# EasyEDA schematic Electric Mokka Pot.json
TITLE: Electric Mokka Pot; REV: 2.3; Date: 2022-07-10; Sheet: 1/1; Company: Kilian Eller
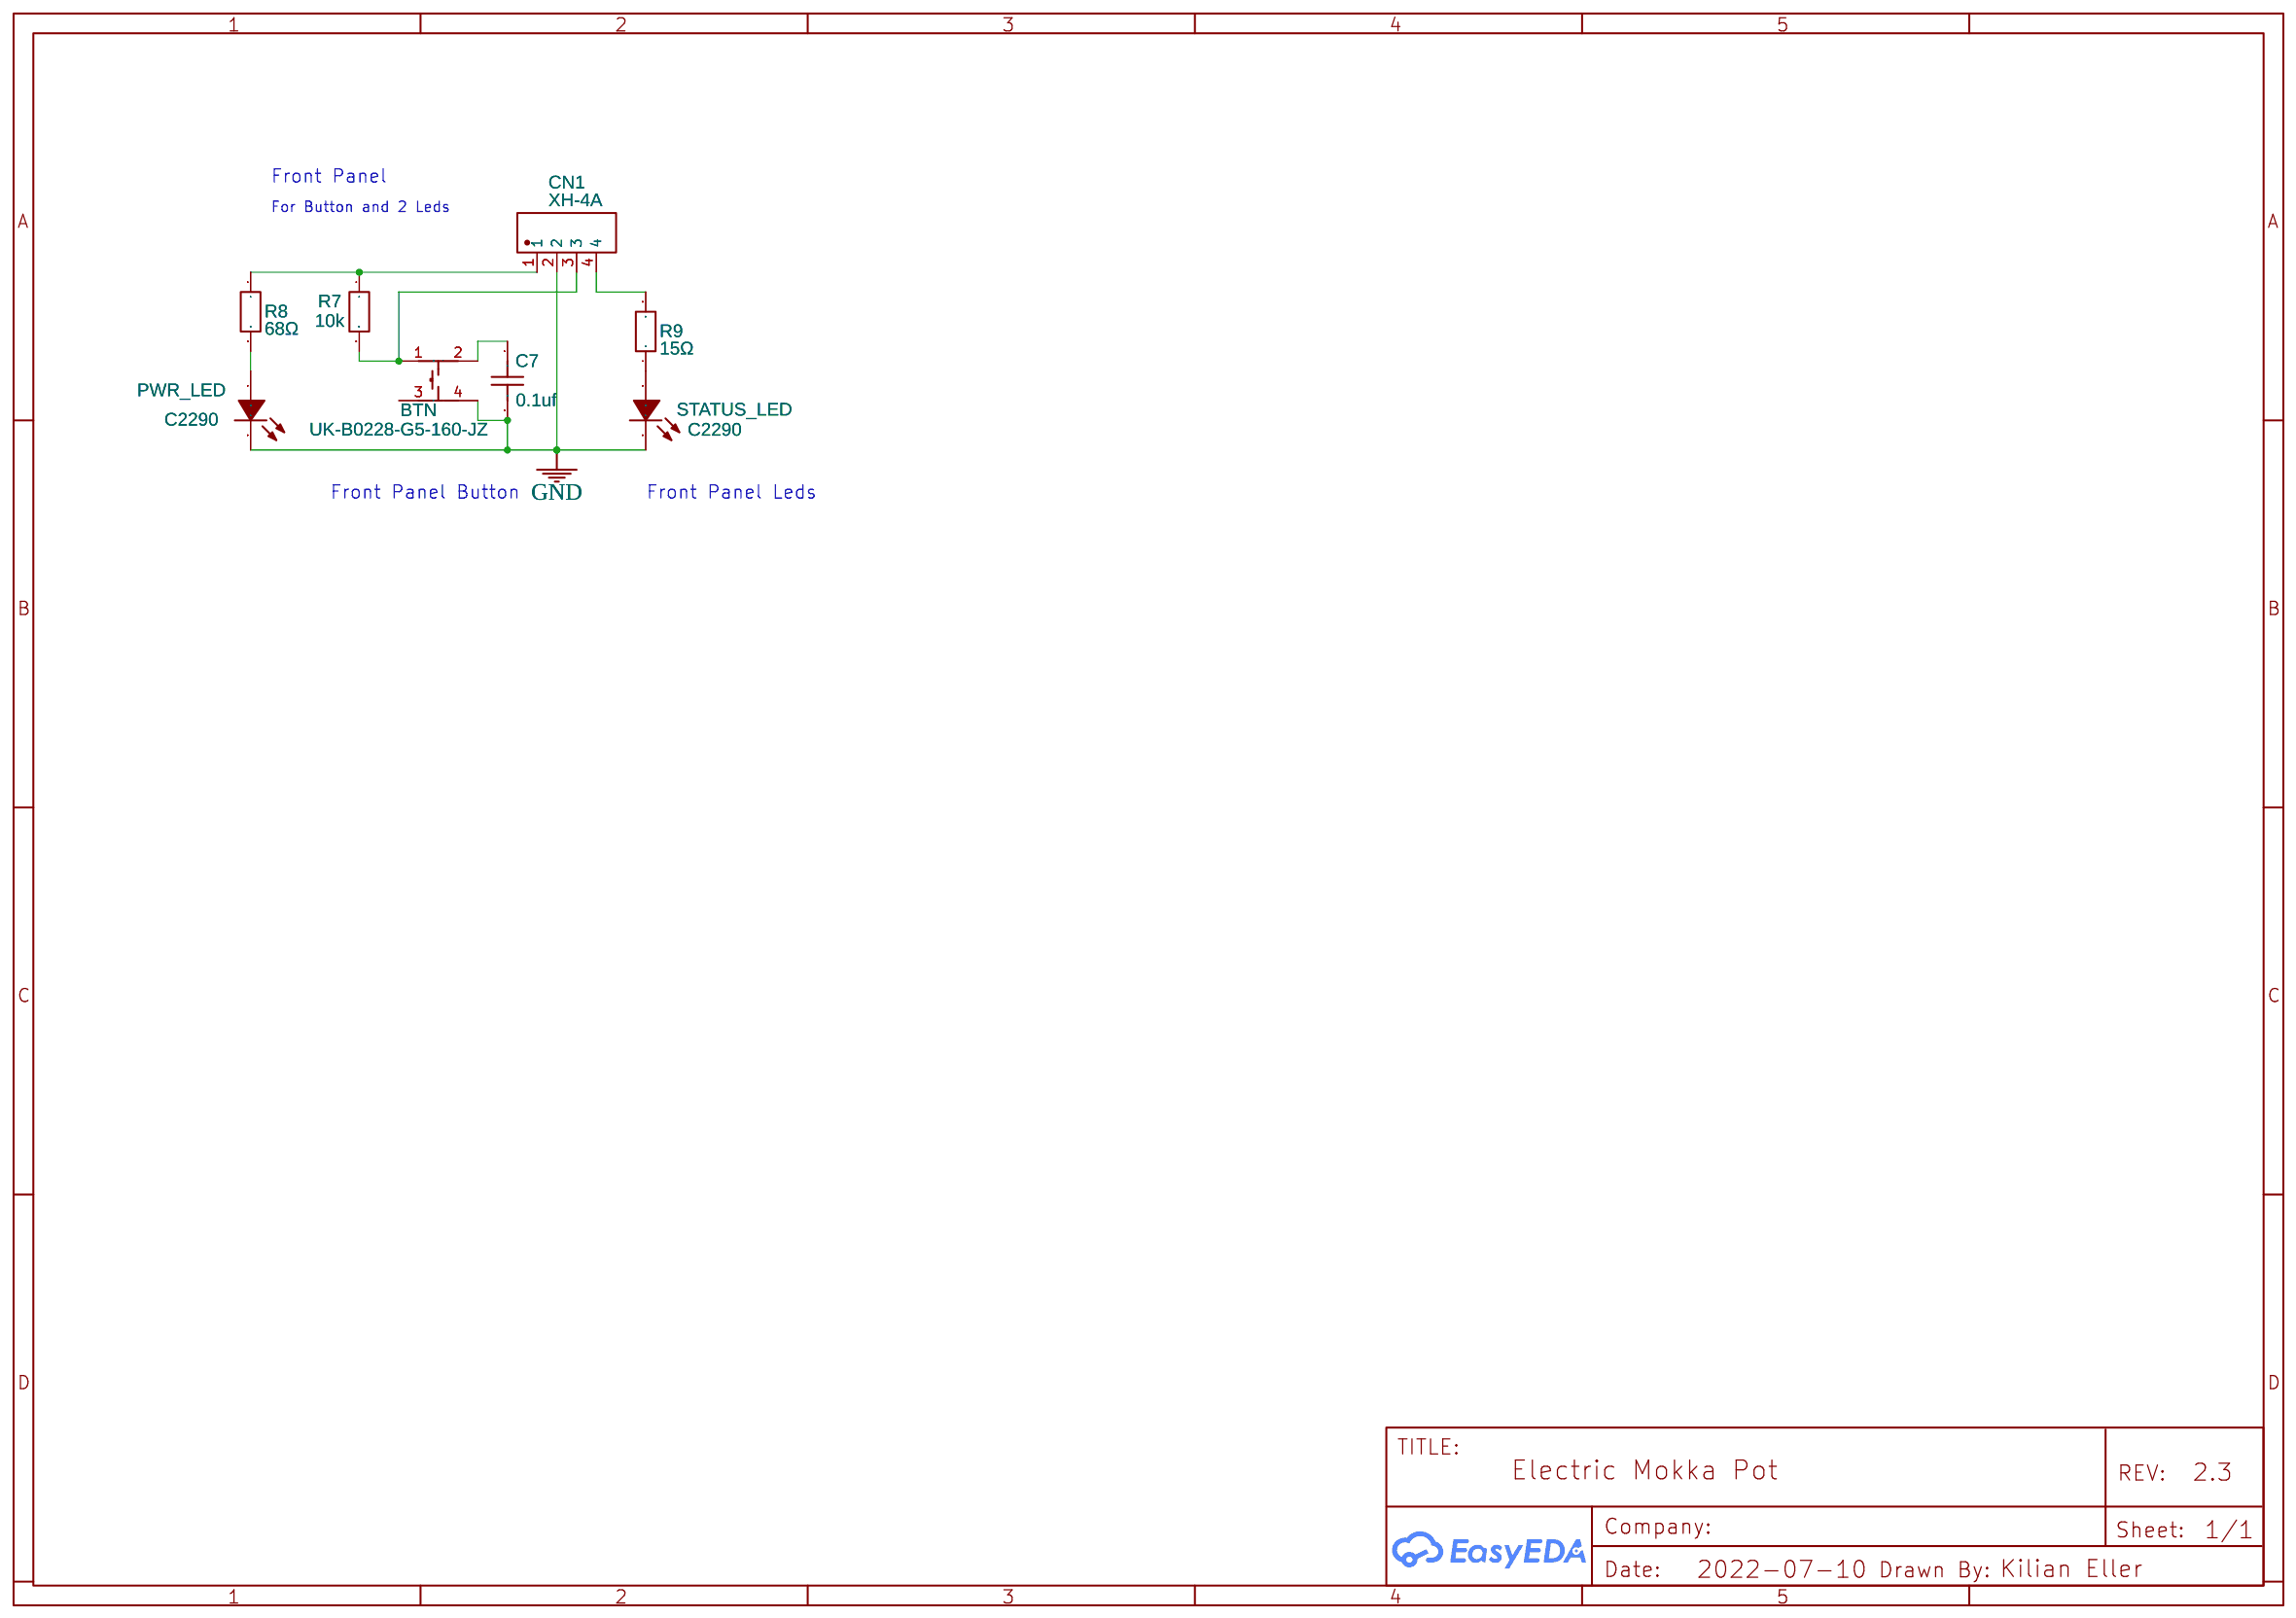
[diagram p0: schematic sheet]

## Parts
BTN  UK-B0228-G5-160-JZ  [KEY-SMD_4P-L6.0-W6.0-P4.50-LS11.0]
C7  0.1uf  [C0603]
CN1  XH-4A  [CONN-TH_XH-4A]
PWR_LED  C2290  [LED0603-R-RD_WHITE]
R7  10k  [R0603]
R8  68Ω  [R0603]
R9  15Ω  [R0603]
STATUS_LED  C2290  [LED0603-R-RD_WHITE]

## Library data of the parts
BTN = UK-B0228-G5-160-JZ: Supplier: LCSC; Supplier Part: C620316; Manufacturer: USAKRO; Contributor: LCSC; JLCPCB Part Class: Extended Part
C7 = C_0603_US: Contributor: LCEDA_Lib
CN1 = XH-4A 黄色: Supplier: LCSC; Supplier Part: C68117; Manufacturer: BOOMELE(博穆精密); JLCPCB Part Class: Extended Part; Contributor: LCSC
PWR_LED STATUS_LED = 0603White light_C2290: Supplier: LCSC; Manufacturer: KENTO; Manufacturer Part: 0603White light; JLCPCB Part Class: Basic Part
R7-R9 = R_0603_EU: Contributor: LCEDA_Lib

## Nets
GND: BTN.4 C7.2 CN1.2 PWR_LED.2(K) STATUS_LED.2(K)
Net-(BTN-1): BTN.1 CN1.3 R7.2
Net-(BTN-2): BTN.2 C7.1
Net-(CN1-1): CN1.1 R7.1 R8.1
Net-(CN1-4): CN1.4 R9.2
Net-(PWR_LED-1): PWR_LED.1(A) R8.2
Net-(R9-1): R9.1 STATUS_LED.1(A)

Not connected (* = marked no-connect by the designer): BTN 3

## Notes on the sheet
- Front Panel
- For Button and 2 Leds
- Front Panel Button
- Front Panel Leds
